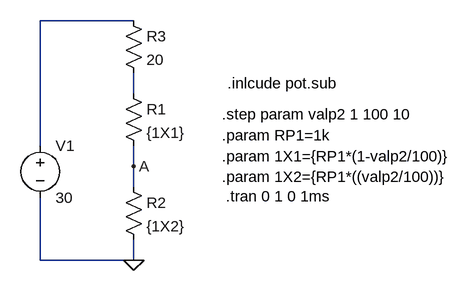
[diagram p0: schematic Draft2.asc]
Draft2.asc, the LTspice schematic file:
Version 4
SHEET 1 880 680
WIRE 240 -64 96 -64
WIRE 240 48 240 16
WIRE 96 128 96 -64
WIRE 240 160 240 128
WIRE 240 192 240 160
WIRE 96 304 96 208
WIRE 240 304 240 272
WIRE 240 304 96 304
FLAG 240 304 0
FLAG 240 160 A
SYMBOL voltage 96 112 R0
WINDOW 123 0 0 Left 0
WINDOW 39 0 0 Left 0
SYMATTR InstName V1
SYMATTR Value 30
SYMBOL res 224 32 R0
SYMATTR InstName R1
SYMATTR Value {1X1}
SYMBOL res 224 176 R0
SYMATTR InstName R2
SYMATTR Value {1X2}
SYMBOL res 224 -80 R0
SYMATTR InstName R3
SYMATTR Value 20
TEXT 376 144 Left 2 !.param 1X1={RP1*(1-valp2/100)}
TEXT 376 176 Left 2 !.param 1X2={RP1*((valp2/100))}
TEXT 376 112 Left 2 !.param RP1=1k
TEXT 376 80 Left 2 !.step param valp2 1 100 10
TEXT 382 206 Left 2 !.tran 0 1 0 1ms
TEXT 384 32 Left 2 !.inlcude pot.sub

The netlist it stands for:
* Draft2.asc
V1 N001 0 30
R1 N002 A {1X1}
R2 A 0 {1X2}
R3 N001 N002 20
.param 1X1={RP1*(1-valp2/100)}
.param 1X2={RP1*((valp2/100))}
.param RP1=1k
.step param valp2 1 100 10
.tran 0 1 0 1ms
.inlcude pot.sub
.backanno
.end